# EAGLE design trigger (EAGLE 9.5.0)
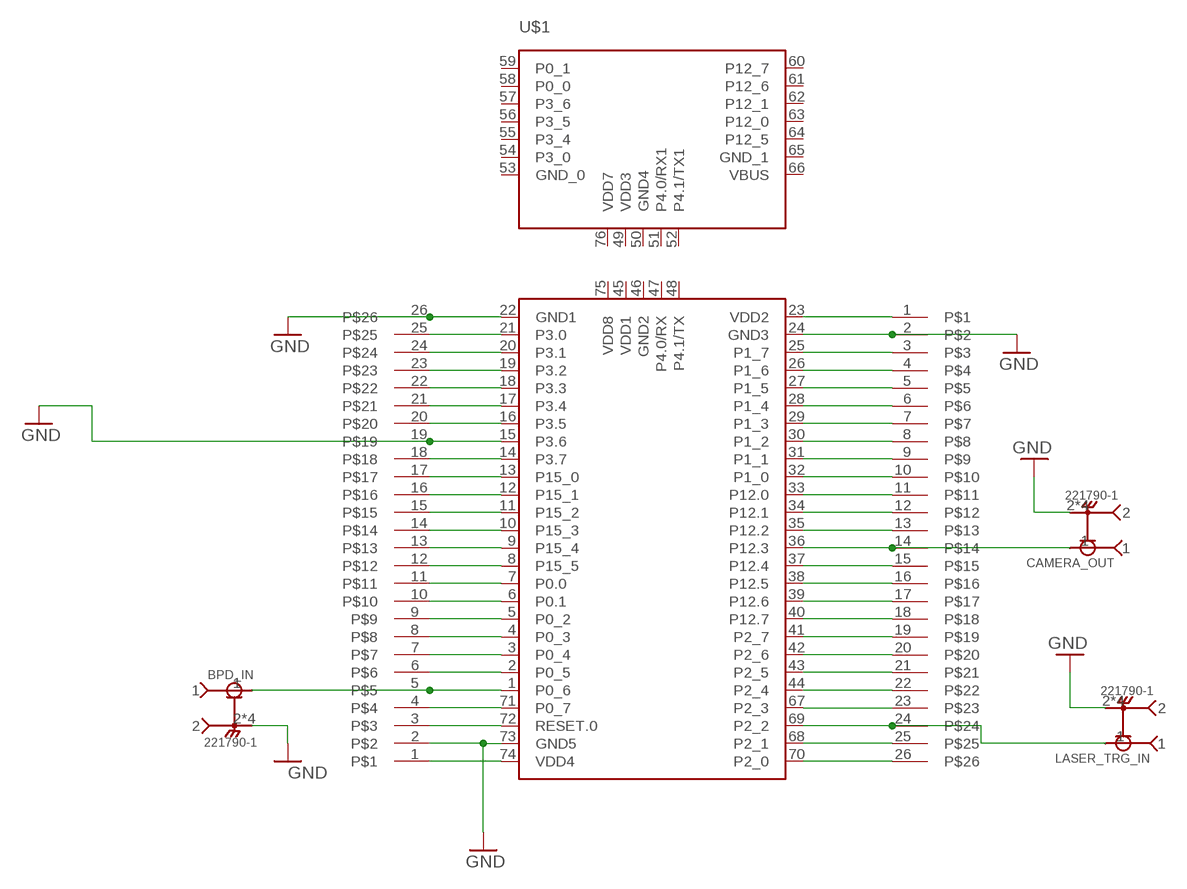
[diagram p0: schematic, sheet 1]

## Parts
BPD_IN  221790-1  [TE_221790-1]
CAMERA_OUT  221790-1  [TE_221790-1]
LASER_TRG_IN  221790-1  [TE_221790-1]
U$1  CY8CKIT-049-42XX  [CY8CKIT-049-42XX]
U$2  PINHEADER_PSOC5LP  [PINHEADER]
U$3  PINHEADER_PSOC5LP  [PINHEADER]

## Nets
GND: BPD_IN.2 BPD_IN.3 BPD_IN.4 BPD_IN.5 CAMERA_OUT.2 CAMERA_OUT.3 CAMERA_OUT.4 CAMERA_OUT.5 LASER_TRG_IN.2 LASER_TRG_IN.3 LASER_TRG_IN.4 LASER_TRG_IN.5 U$1.15(P3.6) U$1.22(GND1) U$1.24(GND3) U$1.73(GND5) U$2.2 U$2.19 U$2.26 U$3.2
N$1: U$1.8(P15_5) U$2.12
N$2: U$1.72(RESET.0) U$2.3
N$3: U$1.21(P3.0) U$2.25
N$4: U$1.20(P3.1) U$2.24
N$5: U$1.19(P3.2) U$2.23
N$6: U$1.18(P3.3) U$2.22
N$7: U$1.17(P3.4) U$2.21
N$8: U$1.16(P3.5) U$2.20
N$9: U$1.67(P2_3) U$3.23
N$10: U$1.14(P3.7) U$2.18
N$11: U$1.13(P15_0) U$2.17
N$12: U$1.12(P15_1) U$2.16
N$13: U$1.11(P15_2) U$2.15
N$14: U$1.10(P15_3) U$2.14
N$15: U$1.9(P15_4) U$2.13
N$16: U$1.7(P0.0) U$2.11
N$17: U$1.5(P0_2) U$2.9
N$18: U$1.4(P0_3) U$2.8
N$19: U$1.3(P0_4) U$2.7
N$20: U$1.2(P0_5) U$2.6
N$21: BPD_IN.1 U$1.1(P0_6) U$2.5
N$22: U$1.71(P0_7) U$2.4
N$24: U$1.6(P0.1) U$2.10
N$25: U$1.74(VDD4) U$2.1
N$26: U$1.23(VDD2) U$3.1
N$28: U$1.25(P1_7) U$3.3
N$29: U$1.26(P1_6) U$3.4
N$30: U$1.27(P1_5) U$3.5
N$31: U$1.28(P1_4) U$3.6
N$32: U$1.29(P1_3) U$3.7
N$33: U$1.30(P1_2) U$3.8
N$34: U$1.31(P1_1) U$3.9
N$35: U$1.32(P1_0) U$3.10
N$36: U$1.33(P12.0) U$3.11
N$37: U$1.34(P12.1) U$3.12
N$38: U$1.35(P12.2) U$3.13
N$39: CAMERA_OUT.1 U$1.36(P12.3) U$3.14
N$40: U$1.37(P12.4) U$3.15
N$41: U$1.38(P12.5) U$3.16
N$42: U$1.39(P12.6) U$3.17
N$43: U$1.40(P12.7) U$3.18
N$44: U$1.41(P2_7) U$3.19
N$45: U$1.42(P2_6) U$3.20
N$46: U$1.43(P2_5) U$3.21
N$47: U$1.44(P2_4) U$3.22
N$48: LASER_TRG_IN.1 U$1.69(P2_2) U$3.24
N$50: U$1.68(P2_1) U$3.25
N$51: U$1.70(P2_0) U$3.26
Unconnected: U$1.45(VDD1) U$1.46(GND2) U$1.47(P4.0/RX) U$1.48(P4.1/TX) U$1.49(VDD3) U$1.50(GND4) U$1.51(P4.0/RX1) U$1.52(P4.1/TX1) U$1.53(GND_0) U$1.54(P3_0) U$1.55(P3_4) U$1.56(P3_5) U$1.57(P3_6) U$1.58(P0_0) U$1.59(P0_1) U$1.60(P12_7) U$1.61(P12_6) U$1.62(P12_1) U$1.63(P12_0) U$1.64(P12_5) U$1.65(GND_1) U$1.66(VBUS) U$1.75(VDD8) U$1.76(VDD7)

## Library data of the parts
BPD_IN CAMERA_OUT LASER_TRG_IN = SMA_connector:221790-1: Connector; SMA; PCB; Right Angle; Stainless Steel; 0.6 in.; Beryllium Copper; AVAILABILITY: Unavailable; COMMENT: 221790-1; DESCRIPTION: Connector; SMA; PCB; Right Angle; Stainless Steel; 0.6 in.; Beryllium Copper; EU_ROHS_COMPLIANCE: Compliant with Exemptions; MF: TE Connectivity; MP: 221790-1; NUMBER_OF_POSITIONS: 1; PACKAGE: None; PRICE: None; TE_PURCHASE_URL: https://www.te.com/usa-en/product-221790-1.html?te_bu=Cor&te_type=disp&te_campaign=seda_glo_cor-seda-global-disp-prtnr-fy19-seda-model-bom-cta_sma-317_1&elqCampaignId=32493
U$1 = PSOC_KIT:CY8CKIT-049-42XX; AVAILABILITY: Unavailable; DESCRIPTION: Development Kit For CY7C6521x Cypress USB-Serial Device; MF: Cypress Semiconductor; MP: CY8CKIT-049-42XX; PACKAGE: None; PRICE: None
U$2 U$3 = PSOC_KIT:PINHEADER_PSOC5LP

## Board
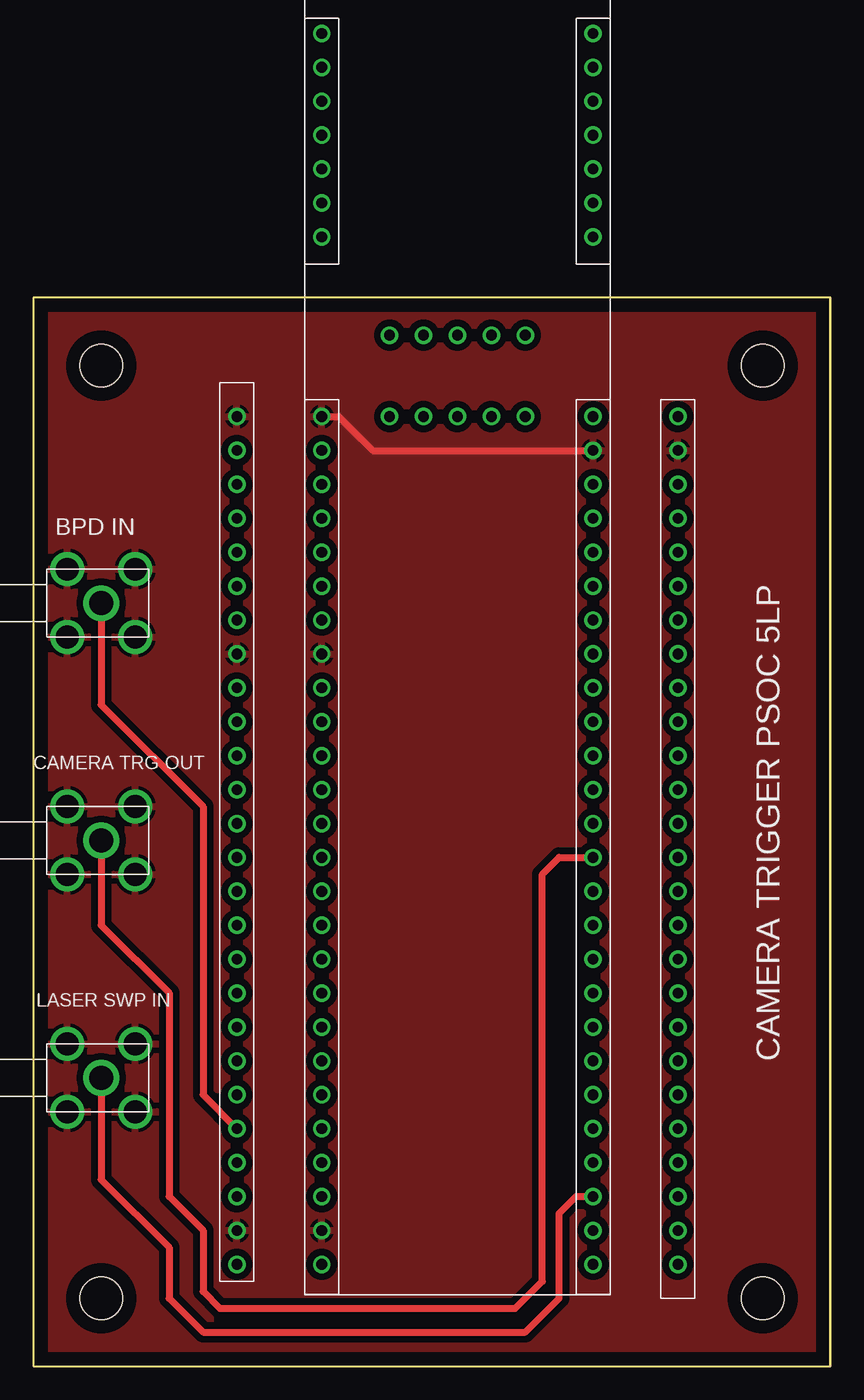
[diagram p1: board, top side]
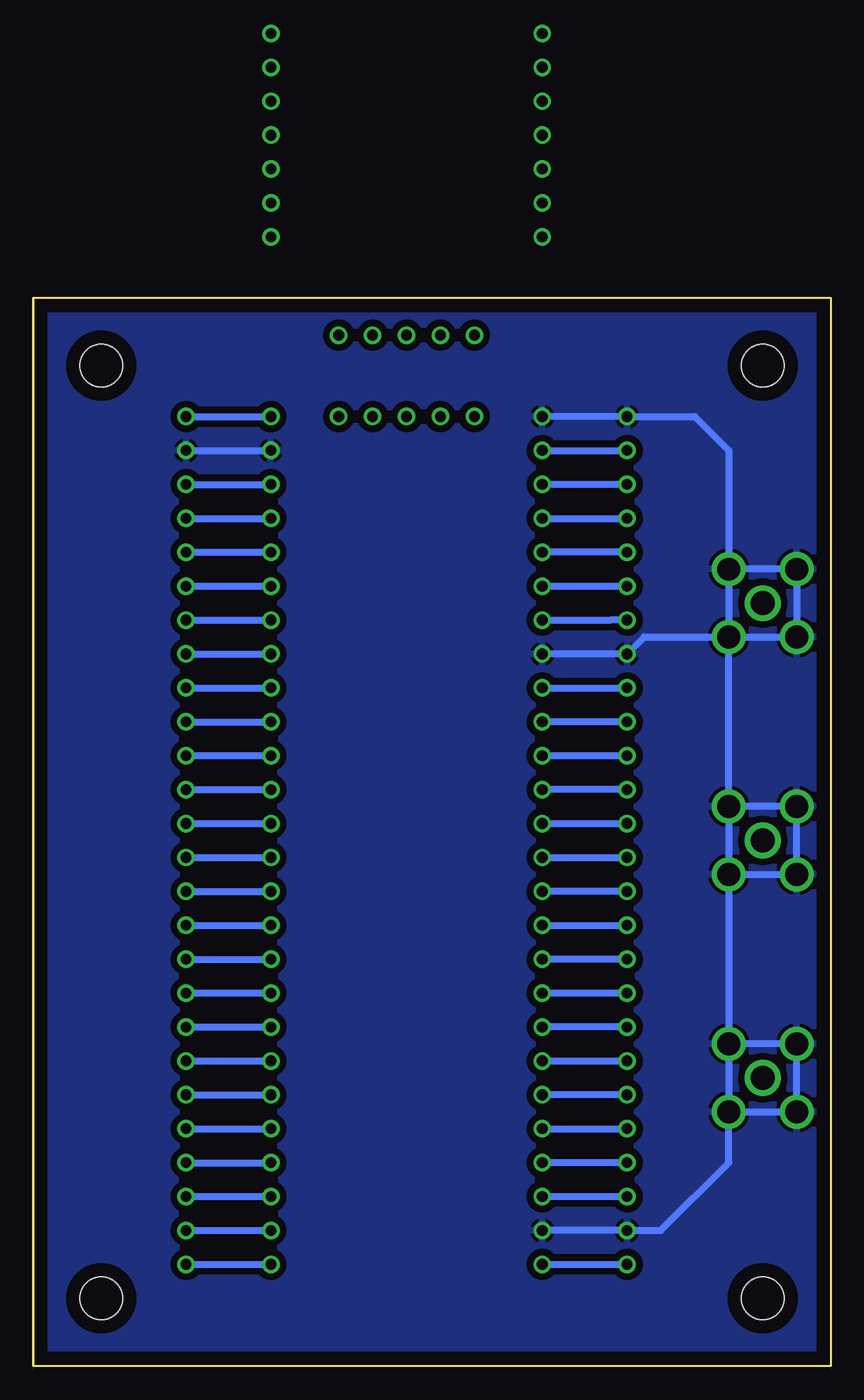
[diagram p2: board, bottom side, seen from below]

Size 59.69 x 80.01 mm. Coordinates in mm from the lower left corner, seen from the top.
Outline: 0,0 59.61,0 59.61,80 0,80 0,0
Outline: 0,0 59.69,0 59.69,80.01 0,80.01 0,0
Copper layers (1*16): Top 0.035mm / dielectric 1.5mm / Bottom 0.035mm
Design rules "default": minimum track width 6mil, minimum drill 0.35mm, track to track 6mil, track to pad 6mil, pad to pad 6mil, via to via 6mil, smd to smd 6mil, copper to edge 40mil, drill to drill 6mil, minimum pad ring 10mil, minimum via ring 8mil, stop-mask expansion 4mil, vias tented up to drill 0mil, thermal gap 10mil
Holes 3.2 mm at 5.08,74.93 54.61,74.93 5.08,5.08 54.61,5.08

### Footprints (pad centres in the part's own frame; a part is rotated, then mirrored left to right if it is on the bottom)
TE_221790-1 = drill 1.778: 1 0,0 | drill 1.702: 2 -2.54,2.54; 3 2.54,2.54; 4 -2.54,-2.54; 5 2.54,-2.54
CY8CKIT-049-42XX = drill 0.8: 1 -10.16,-29.21; 2 -10.16,-26.67; 3 -10.16,-24.13; 4 -10.16,-21.59; 5 -10.16,-19.05; 6 -10.16,-16.51; 7 -10.16,-13.97; 8 -10.16,-11.43; 9 -10.16,-8.89; 10 -10.16,-6.35; 11 -10.16,-3.81; 12 -10.16,-1.27; 13 -10.16,1.27; 14 -10.16,3.81; 15 -10.16,6.35; 16 -10.16,8.89; 17 -10.16,11.43; 18 -10.16,13.97; 19 -10.16,16.51; 20 -10.16,19.05; 21 -10.16,21.59; 22 -10.16,24.13; 23 10.16,24.13; 24 10.16,21.59; 25 10.16,19.05; 26 10.16,16.51; 27 10.16,13.97; 28 10.16,11.43; 29 10.16,8.89; 30 10.16,6.35; 31 10.16,3.81; 32 10.16,1.27; 33 10.16,-1.27; 34 10.16,-3.81; 35 10.16,-6.35; 36 10.16,-8.89; 37 10.16,-11.43; 38 10.16,-13.97; 39 10.16,-16.51; 40 10.16,-19.05; 41 10.16,-21.59; 42 10.16,-24.13; 43 10.16,-26.67; 44 10.16,-29.21; 45 -5.08,24.13; 46 -2.54,24.13; 47 0,24.13; 48 2.54,24.13; 49 -5.08,30.226; 50 -2.54,30.226; 51 0,30.226; 52 2.54,30.226; 53 -10.16,37.592; 54 -10.16,40.132; 55 -10.16,42.672; 56 -10.16,45.212; 57 -10.16,47.752; 58 -10.16,50.292; 59 -10.16,52.832; 60 10.16,52.832; 61 10.16,50.292; 62 10.16,47.752; 63 10.16,45.212; 64 10.16,42.672; 65 10.16,40.132; 66 10.16,37.592; 67 10.16,-31.75; 68 10.16,-36.83; 69 10.16,-34.29; 70 10.16,-39.37; 71 -10.16,-31.75; 72 -10.16,-34.29; 73 -10.16,-36.83; 74 -10.16,-39.37; 75 5.08,24.13; 76 5.08,30.226
PINHEADER = drill 0.8: 1 -7.62,39.37; 2 -7.62,36.83; 3 -7.62,34.29; 4 -7.62,31.75; 5 -7.62,29.21; 6 -7.62,26.67; 7 -7.62,24.13; 8 -7.62,21.59; 9 -7.62,19.05; 10 -7.62,16.51; 11 -7.62,13.97; 12 -7.62,11.43; 13 -7.62,8.89; 14 -7.62,6.35; 15 -7.62,3.81; 16 -7.62,1.27; 17 -7.62,-1.27; 18 -7.62,-3.81; 19 -7.62,-6.35; 20 -7.62,-8.89; 21 -7.62,-11.43; 22 -7.62,-13.97; 23 -7.62,-16.51; 24 -7.62,-19.05; 25 -7.62,-21.59; 26 -7.62,-24.13

### Placement (x,y rotation side)
BPD_IN  5.08,57.15 180 top
CAMERA_OUT  5.08,39.37 180 top
LASER_TRG_IN  5.08,21.59 180 top
U$1  31.75,46.99 0 top
U$2  7.62,46.99 180 top
U$3  55.88,31.75 0 top

### Tracks (layer width: path | path; a pad name or v marks a point on that pad's centre or on a via)
GND
  Top 0.508: U$1.22 22.86,71.12 25.4,68.58 U$1.24
  Bottom 0.508: BPD_IN.4 BPD_IN.5 BPD_IN.3 BPD_IN.2 | BPD_IN.4 BPD_IN.2 | CAMERA_OUT.4 CAMERA_OUT.5 CAMERA_OUT.3 CAMERA_OUT.2 | CAMERA_OUT.4 CAMERA_OUT.2 | LASER_TRG_IN.4 LASER_TRG_IN.5 LASER_TRG_IN.3 LASER_TRG_IN.2 | LASER_TRG_IN.4 LASER_TRG_IN.2 | BPD_IN.2 13.97,54.61 U$2.19 U$1.15 | CAMERA_OUT.4 BPD_IN.2 | CAMERA_OUT.2 LASER_TRG_IN.4 | U$3.2 U$1.24 | BPD_IN.4 7.62,68.58 10.16,71.12 U$2.26 U$1.22 | U$1.73 U$2.2 12.7,10.16 7.62,15.24 LASER_TRG_IN.2
  pour Top (isolate 0.508): 0,80.01 59.69,80.01 59.69,0 0,0
  pour Top (isolate 0.508): 0,80.01 59.69,80.01 59.69,0 0,0
  pour Bottom (isolate 0.508): 0,80.01 59.69,80.01 59.69,0 0,0
N$1
  Bottom 0.508: U$2.12 U$1.8
N$2
  Bottom 0.508: U$1.72 U$2.3
N$3
  Bottom 0.508: U$1.21 U$2.25
N$4
  Bottom 0.508: U$2.24 U$1.20
N$5
  Bottom 0.508: U$1.19 U$2.23
N$6
  Bottom 0.508: U$2.22 U$1.18
N$7
  Bottom 0.508: U$1.17 U$2.21
N$8
  Bottom 0.508: U$1.16 17.78,55.88 16.51,55.88 U$2.20
N$9
  Bottom 0.508: U$3.23 U$1.67
N$10
  Bottom 0.508: U$1.14 U$2.18
N$11
  Bottom 0.508: U$2.17 U$1.13
N$12
  Bottom 0.508: U$1.12 U$2.16
N$13
  Bottom 0.508: U$2.15 U$1.11
N$14
  Bottom 0.508: U$1.10 U$2.14
N$15
  Bottom 0.508: U$1.9 U$2.13
N$16
  Bottom 0.508: U$1.7 U$2.11
N$17
  Bottom 0.508: U$1.5 U$2.9
N$18
  Bottom 0.508: U$2.8 U$1.4
N$19
  Bottom 0.508: U$1.3 U$2.7
N$20
  Bottom 0.508: U$2.6 U$1.2
N$21
  Top 0.508: BPD_IN.1 5.08,49.53 12.7,41.91 12.7,20.32 U$2.5
  Bottom 0.508: U$1.1 U$2.5
N$22
  Bottom 0.508: U$2.4 U$1.71
N$24
  Bottom 0.508: U$2.10 U$1.6
N$25
  Bottom 0.508: U$1.74 U$2.1
N$26
  Bottom 0.508: U$3.1 U$1.23
N$28
  Bottom 0.508: U$3.3 U$1.25
N$29
  Bottom 0.508: U$3.4 U$1.26
N$30
  Bottom 0.508: U$3.5 U$1.27
N$31
  Bottom 0.508: U$3.6 U$1.28
N$32
  Bottom 0.508: U$3.7 U$1.29
N$33
  Bottom 0.508: U$3.8 U$1.30
N$34
  Bottom 0.508: U$3.9 U$1.31
N$35
  Bottom 0.508: U$3.10 U$1.32
N$36
  Bottom 0.508: U$3.11 U$1.33
N$37
  Bottom 0.508: U$3.12 U$1.34
N$38
  Bottom 0.508: U$3.13 U$1.35
N$39
  Top 0.508: CAMERA_OUT.1 5.08,33.02 10.16,27.94 10.16,12.7 12.7,10.16 12.7,5.59 13.97,4.32 36.07,4.32 38.1,6.35 38.1,36.83 39.37,38.1 U$1.36
  Bottom 0.508: U$3.14 U$1.36
N$40
  Bottom 0.508: U$3.15 U$1.37
N$41
  Bottom 0.508: U$3.16 U$1.38
N$42
  Bottom 0.508: U$3.17 U$1.39
N$43
  Bottom 0.508: U$3.18 U$1.40
N$44
  Bottom 0.508: U$3.19 U$1.41
N$45
  Bottom 0.508: U$3.20 U$1.42
N$46
  Bottom 0.508: U$3.21 U$1.43
N$47
  Bottom 0.508: U$3.22 U$1.44
N$48
  Top 0.508: LASER_TRG_IN.1 5.08,13.97 10.16,8.89 10.16,5.08 12.7,2.54 36.83,2.54 39.37,5.08 39.37,11.43 40.64,12.7 U$1.69
  Bottom 0.508: U$3.24 U$1.69
N$50
  Bottom 0.508: U$3.25 U$1.68
N$51
  Bottom 0.508: U$3.26 U$1.70

### Text on the board
tPlace: CAMERA TRIGGER PSOC 5LP
tNames: BPD IN | CAMERA TRG OUT | LASER SWP IN